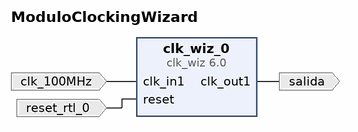
[diagram p0: block diagram of the top level]
# Vivado block design ModuloClockingWizard, xc7s25csga324-2, Vivado 2023.2
create_bd_design ModuloClockingWizard

create_bd_port -dir I -type clk clk_100MHz
set_property -dict {CONFIG.FREQ_HZ 100000000} [get_bd_ports clk_100MHz]
create_bd_port -dir I -type rst reset_rtl_0
set_property -dict {CONFIG.POLARITY ACTIVE_HIGH} [get_bd_ports reset_rtl_0]
create_bd_port -dir O -type clk salida

create_bd_cell -type ip -vlnv xilinx.com:ip:clk_wiz:6.0 clk_wiz_0
set_property -dict [list \
  CONFIG.CLKOUT1_JITTER 511.931 \
  CONFIG.CLKOUT1_PHASE_ERROR 496.904 \
  CONFIG.CLKOUT1_REQUESTED_OUT_FREQ 8.3886 \
  CONFIG.MMCM_CLKFBOUT_MULT_F 58.500 \
  CONFIG.MMCM_CLKOUT0_DIVIDE_F 99.625 \
  CONFIG.MMCM_DIVCLK_DIVIDE 7 \
  CONFIG.PRIM_IN_FREQ 100 \
  CONFIG.USE_LOCKED false \
] [get_bd_cells clk_wiz_0]

# ---- connections ----

connect_bd_net [get_bd_ports clk_100MHz] [get_bd_pins clk_wiz_0/clk_in1]
connect_bd_net [get_bd_pins clk_wiz_0/clk_out1] [get_bd_ports salida]
connect_bd_net -net reset_rtl_0_1 [get_bd_ports reset_rtl_0] [get_bd_pins clk_wiz_0/reset]

validate_bd_design
save_bd_design
